# Altium schematic sheet Fpga.SchDoc
size A4; SheetNumber: 1; SheetTotal: 2
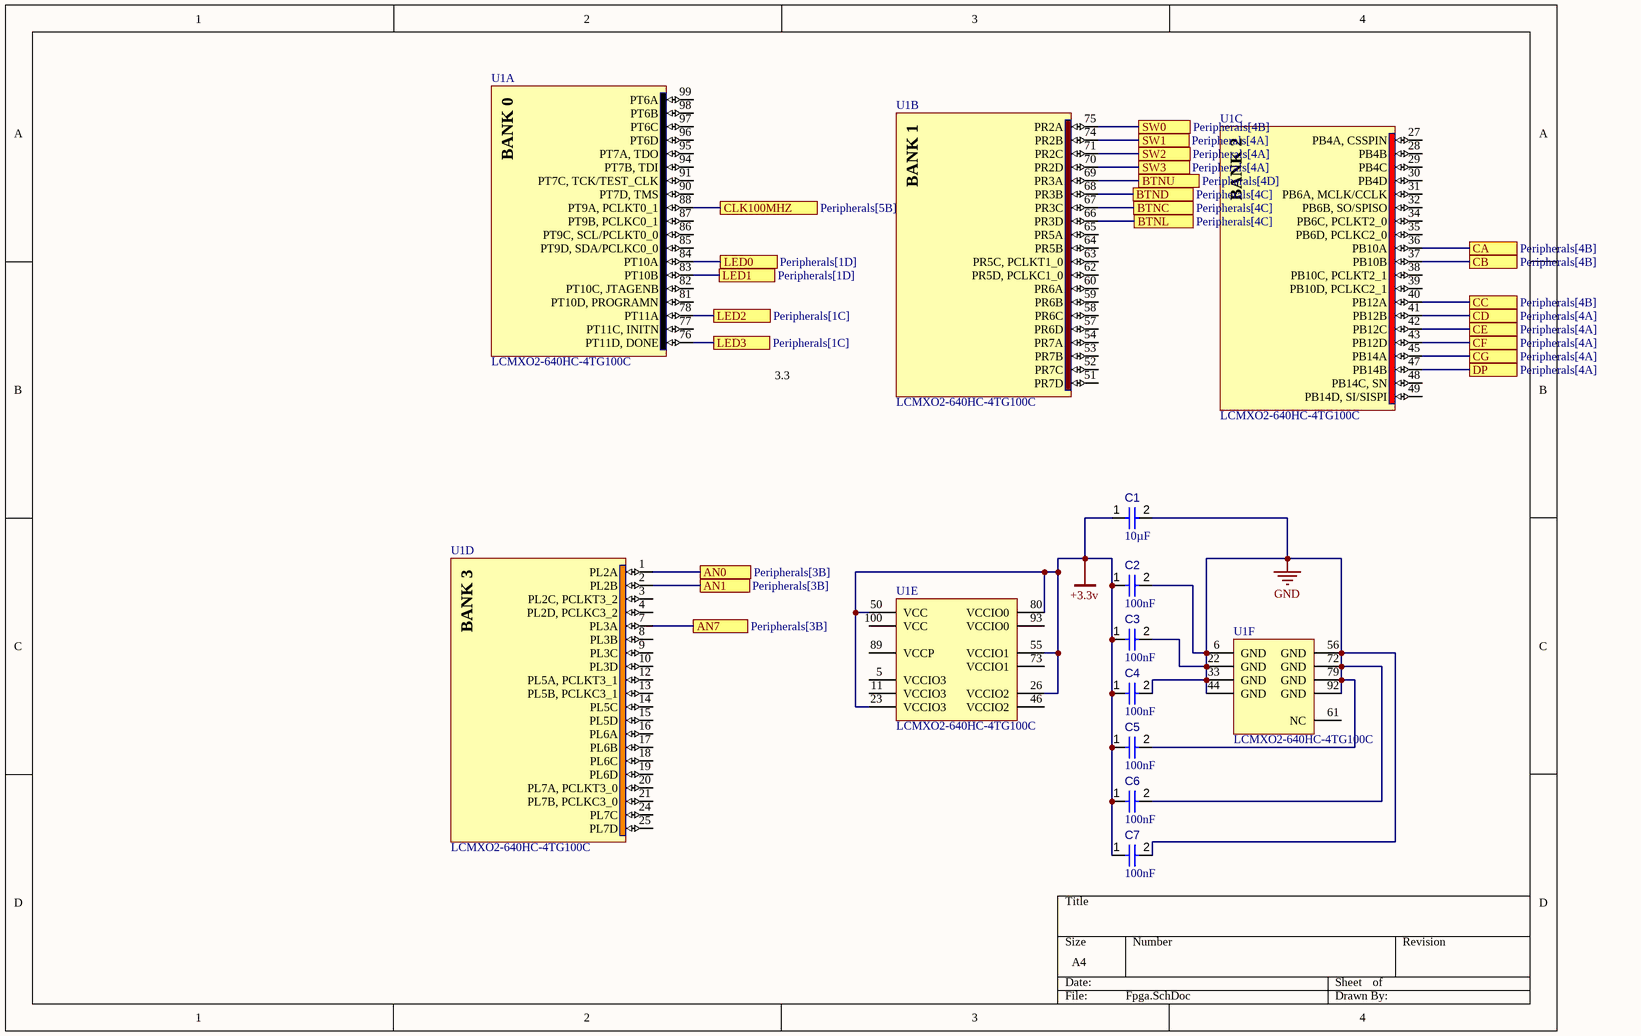
[diagram p0: Fpga.SchDoc]

## Parts
C1  value 10µF  [CAPC0805(2012)145_L]  (hidden comment: Capacitor 10µF +/-20% 25V 0805)
C2  value 100nF  [CAPC0402(1005)60_L]  (hidden comment: Capacitor 100nF +/-20% 10V 0402)
C3  value 100nF  [CAPC0402(1005)60_L]  (hidden comment: Capacitor 100nF +/-20% 10V 0402)
C4  value 100nF  [CAPC0402(1005)60_L]  (hidden comment: Capacitor 100nF +/-20% 10V 0402)
C5  value 100nF  [CAPC0402(1005)60_L]  (hidden comment: Capacitor 100nF +/-20% 10V 0402)
C6  value 100nF  [CAPC0402(1005)60_L]  (hidden comment: Capacitor 100nF +/-20% 10V 0402)
C7  value 100nF  [CAPC0402(1005)60_L]  (hidden comment: Capacitor 100nF +/-20% 10V 0402)
U1  LCMXO2-640HC-4TG100C  [TQFP100_M]  (parts A,B,C,D,E,F of 6)

## Ports
AN0 (see Peripherals[3B]), AN1 (see Peripherals[3B]), AN7 (see Peripherals[3B]), BTNC (see Peripherals[4C]), BTND (see Peripherals[4C]), BTNL (see Peripherals[4C]), BTNU (see Peripherals[4D]), CA (see Peripherals[4B]), CB (see Peripherals[4B]), CC (see Peripherals[4B]), CD (see Peripherals[4A]), CE (see Peripherals[4A]), CF (see Peripherals[4A]), CG (see Peripherals[4A]), CLK100MHZ (see Peripherals[5B]), DP (see Peripherals[4A]), LED0 (see Peripherals[1D]), LED1 (see Peripherals[1D]), LED2 (see Peripherals[1C]), LED3 (see Peripherals[1C]), SW0 (see Peripherals[4B]), SW1 (see Peripherals[4A]), SW2 (see Peripherals[4A]), SW3 (see Peripherals[4A])

## Nets
+3.3v: C1.1 C2.1 C3.1 C4.1 C5.1 C6.1 C7.1 U1.23(VCCIO3) U1.26(VCCIO2) U1.50(VCC) U1.55(VCCIO1) U1.80(VCCIO0)
GND: C1.2 C2.2 C3.2 C4.2 C5.2 C6.2 C7.2 U1.6(GND) U1.22(GND) U1.33(GND) U1.44(GND) U1.56(GND) U1.72(GND) U1.79(GND) U1.92(GND)
AN0: U1.1(PL2A) ; port AN0
AN1: U1.2(PL2B) ; port AN1
AN7: U1.7(PL3A) ; port AN7
BTNC: U1.67(PR3C) ; port BTNC
BTND: U1.68(PR3B) ; port BTND
BTNL: U1.66(PR3D) ; port BTNL
BTNU: U1.69(PR3A) ; port BTNU
CA: U1.36(PB10A) ; port CA
CB: U1.37(PB10B) ; port CB
CC: U1.40(PB12A) ; port CC
CD: U1.41(PB12B) ; port CD
CE: U1.42(PB12C) ; port CE
CF: U1.43(PB12D) ; port CF
CG: U1.45(PB14A) ; port CG
CLK100MHZ: U1.88(PT9A,_PCLKT0_1) ; port CLK100MHZ
DP: U1.47(PB14B) ; port DP
LED0: U1.84(PT10A) ; port LED0
LED1: U1.83(PT10B) ; port LED1
LED2: U1.78(PT11A) ; port LED2
LED3: U1.76(PT11D,_DONE) ; port LED3
SW0: U1.75(PR2A) ; port SW0
SW1: U1.74(PR2B) ; port SW1
SW2: U1.71(PR2C) ; port SW2
SW3: U1.70(PR2D) ; port SW3

Not connected (* = marked no-connect by the designer): U1 3(PL2C,_PCLKT3_2) 4(PL2D,_PCLKC3_2) 5(VCCIO3) 8(PL3B) 9(PL3C) 10(PL3D) 11(VCCIO3) 12(PL5A,_PCLKT3_1) 13(PL5B,_PCLKC3_1) 14(PL5C) 15(PL5D) 16(PL6A) 17(PL6B) 18(PL6C) 19(PL6D) 20(PL7A,_PCLKT3_0) 21(PL7B,_PCLKC3_0) 24(PL7C) 25(PL7D) 27(PB4A,_CSSPIN) 28(PB4B) 29(PB4C) 30(PB4D) 31(PB6A,_MCLK/CCLK) 32(PB6B,_SO/SPISO) 34(PB6C,_PCLKT2_0) 35(PB6D,_PCLKC2_0) 38(PB10C,_PCLKT2_1) 39(PB10D,_PCLKC2_1) 46(VCCIO2) 48(PB14C,_SN) 49(PB14D,_SI/SISPI) 51(PR7D) 52(PR7C) 53(PR7B) 54(PR7A) 57(PR6D) 58(PR6C) 59(PR6B) 60(PR6A) 61(NC) 62(PR5D,_PCLKC1_0) 63(PR5C,_PCLKT1_0) 64(PR5B) 65(PR5A) 73(VCCIO1) 77(PT11C,_INITN) 81(PT10D,_PROGRAMN) 82(PT10C,_JTAGENB) 85(PT9D,_SDA/PCLKC0_0) 86(PT9C,_SCL/PCLKT0_0) 87(PT9B,_PCLKC0_1) 89(VCCP) 90(PT7D,_TMS) 91(PT7C,_TCK/TEST_CLK) 93(VCCIO0) 94(PT7B,_TDI) 95(PT7A,_TDO) 96(PT6D) 97(PT6C) 98(PT6B) 99(PT6A) 100(VCC)

## Notes on the sheet
- 3.3
- (in symbol CMP-0111-00271-1, part A) BANK 0
- (in symbol CMP-0111-00271-1, part B) BANK 1
- (in symbol CMP-0111-00271-1, part C) BANK 2
- (in symbol CMP-0111-00271-1, part D) BANK 3

## Library data of the parts
C1 = CMP-001-00079-4: Chip Capacitor, 10µF +/-20%, 25V, 0805, Thickness 1.45 mm; Tolerance: 10%; Max Operating Temperature: 85°C; Case/Package: 0805; Voltage Rating: 25V; Min Operating Temperature: -55°C; Mounting Technology: SMT; Pins: 2
C2-C7 = CMP-001-00061-3: Chip Capacitor, 100nF +/-20%, 10V, 0402, Thickness 0.6 mm; Tolerance: 20%; Mounting Technology: SMT; Voltage Rating: 10V; Max Operating Temperature: 85°C; Pins: 2; Case/Package: 0402; Min Operating Temperature: -55°C
U1 = CMP-0111-00271-1: MachXO2 High Performance CPLD with 640 LUTs, Voltage Regulator, 2.5V/3.3V, 100-pin TQFP, Speed Grade-4, Commercial Grade, Halogen Free (RoHS); PackageDescription: 100-Pin Thin Quad Flat Pack (TQFP100); PackageVersion: ver02.6, Nov-2010; PackageReference: TQFP100; Code_JEDEC: MS-026-BED; DatasheetVersion: ver01.0, Nov-2010